# Altium project Temp_sensor_can.PrjPcb
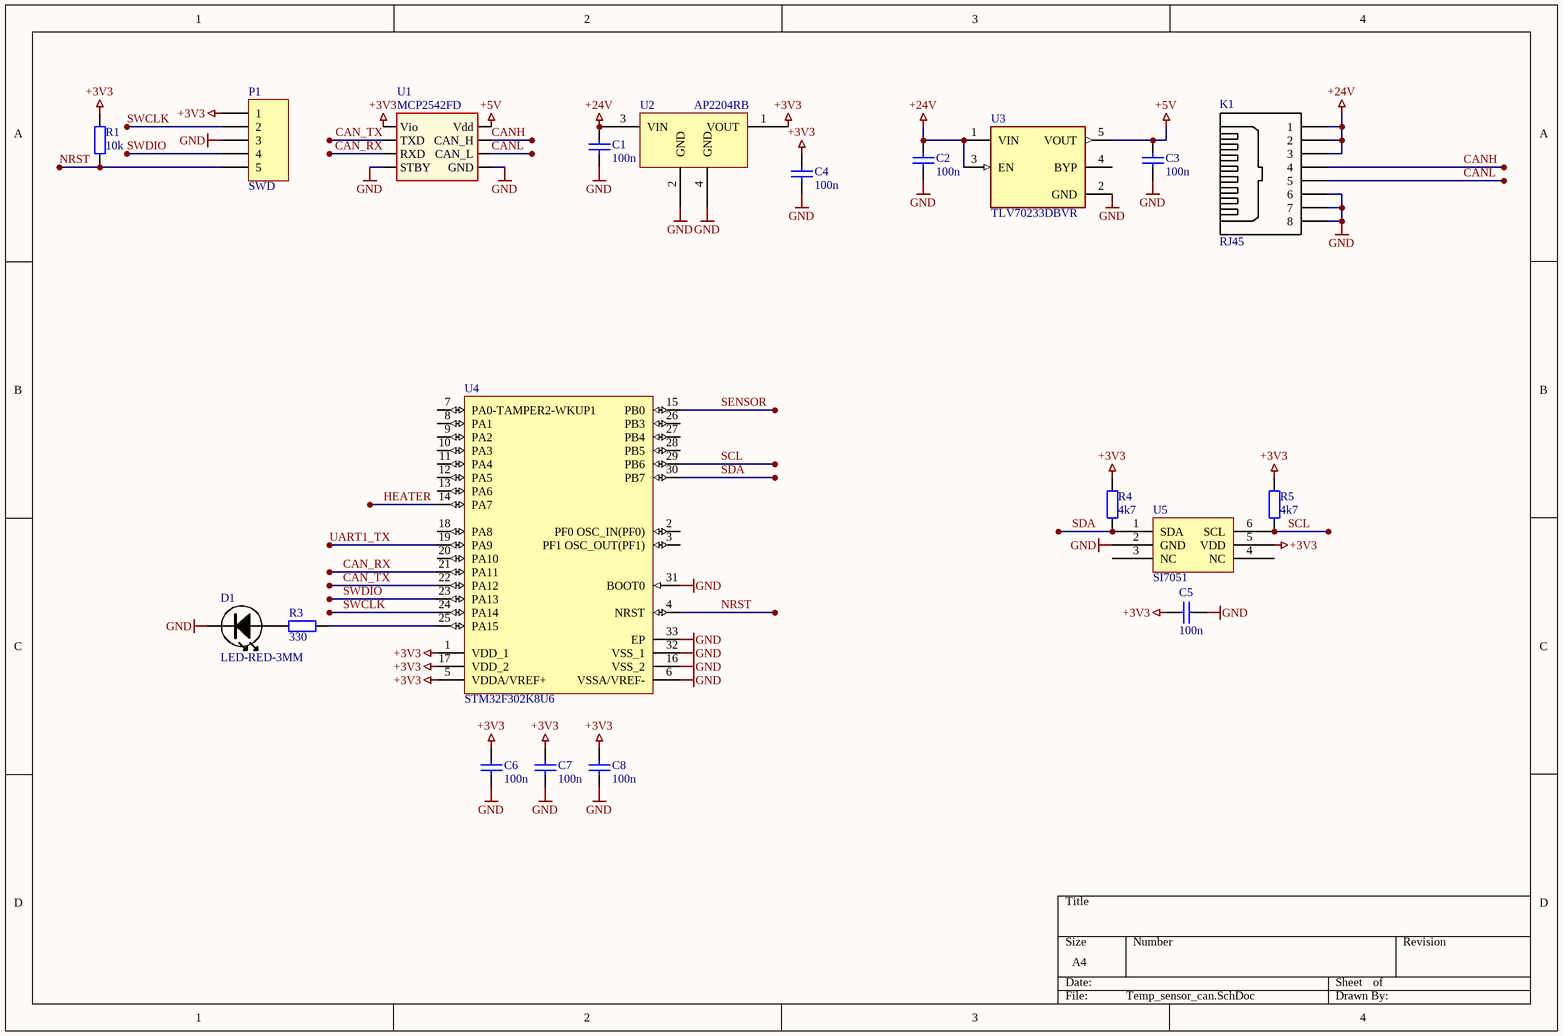
[diagram p0: Temp_sensor_can.SchDoc]
1 sheet, 20 parts. Net scope: global (net labels, ports and power ports of the same name join across sheets).

## Sheet Temp_sensor_can.SchDoc
size A4

### Parts
C1  value 100n  [0603C-GENERIC]  (hidden comment: Cap)
C2  value 100n  [0603C-GENERIC]  (hidden comment: Cap)
C3  value 100n  [0603C-GENERIC]  (hidden comment: Cap)
C4  value 100n  [0603C-GENERIC]  (hidden comment: Cap)
C5  value 100n  [0603C-GENERIC]  (hidden comment: Cap)
C6  value 100n  [0603C-GENERIC]  (hidden comment: Cap)
C7  value 100n  [0603C-GENERIC]  (hidden comment: Cap)
C8  value 100n  [0603C-GENERIC]  (hidden comment: Cap)
D1  LED-RED-3MM  [LED-3MM-GREEN]
K1  RJ45  [rj45 - edge]
P1  SWD  [HDR1X5]
R1  value 10k  [0603R-GENERIC]  (hidden comment: Res2)
R3  value 330  [0603R-GENERIC]  (hidden comment: Res2)
R4  value 4k7  [0603R-GENERIC]  (hidden comment: Res2)
R5  value 4k7  [0603R-GENERIC]  (hidden comment: Res2)
U1  MCP2542FD  [SO8]
U2  AP2204RB  [SOT-89]
U3  TLV70233DBVR  [FP-SOT25-IPC_B]
U4  STM32F302K8U6  [UFQFPN32_M]
U5  SI7051  [DFN_6P]

### Nets
+3V3: C4.2 C5.2 C6.1 C7.1 C8.1 P1.1 R1.2 R4.2 R5.2 U1.5(Vio) U2.1(VOUT) U4.1(VDD_1) U4.5(VDDA/VREF+) U4.17(VDD_2) U5.5(VDD)
+5V: C3.2 U1.3(Vdd) U3.5(VOUT)
+24V: C1.2 C2.2 K1.1 K1.2 K1.3 U2.3(VIN) U3.1(VIN) U3.3(EN)
GND: C1.1 C2.1 C3.1 C4.1 C5.1 C6.2 C7.2 C8.2 D1.K K1.6 K1.7 K1.8 P1.3 U1.2(GND) U1.8(STBY) U2.2(GND) U2.4(GND) U3.2(GND) U4.6(VSSA/VREF-) U4.16(VSS_2) U4.31(BOOT0) U4.32(VSS_1) U4.33(EP) U5.2(GND)
CAN_RX: U1.4(RXD) U4.21(PA11)
CAN_TX: U1.1(TXD) U4.22(PA12)
CANH: K1.4 U1.7(CAN_H)
CANL: K1.5 U1.6(CAN_L)
HEATER: U4.14(PA7)
NRST: P1.5 R1.1 U4.4(NRST)
SCL: R5.1 U4.29(PB6) U5.6(SCL)
SDA: R4.1 U4.30(PB7) U5.1(SDA)
SENSOR: U4.15(PB0)
SWCLK: P1.2 U4.24(PA14)
SWDIO: P1.4 U4.23(PA13)
UART1_TX: U4.19(PA9)
NetD1_A: D1.A R3.1
NetR3_2: R3.2 U4.25(PA15)

Not connected (* = marked no-connect by the designer): U3 4(BYP); U4 2(PF0_OSC_IN(PF0)) 3(PF1_OSC_OUT(PF1)) 7(PA0-TAMPER2-WKUP1) 8(PA1) 9(PA2) 10(PA3) 11(PA4) 12(PA5) 13(PA6) 18(PA8) 20(PA10) 26(PB3) 27(PB4) 28(PB5); U5 3(NC) 4(NC)

### Library data of the parts
C1-C8 = Cap: Capacitor; Published: 8-Jun-2000; LatestRevisionDate: 17-Jul-2002; LatestRevisionNote: Re-released for DXP Platform.; PackageReference: RAD-0.3; Publisher: Altium Limited; PackageDescription: Radial Cap, Thru-Hole; 2 Leads; 0.3 in Pin Spacing
D1 = LED-GREEN-3MM
K1 = RJ45: Text Field1: STEWART CONNECTOR; Text Field2: SS-73100-047; Text Field3: DIGIKEY; Text Field4: 380-1053-ND
P1 = Header 5: Header, 5-Pin; LatestRevisionDate: 17-Jul-2002; LatestRevisionNote: Re-released for DXP Platform.; Publisher: Altium Limited
R1 R3-R5 = Res2: Resistor; Published: 8-Jun-2000; LatestRevisionDate: 17-Jul-2002; LatestRevisionNote: Re-released for DXP Platform.; PackageReference: AXIAL-0.4; Publisher: Altium Limited; PackageDescription: Axial Device, Thru-Hole; 2 Leads; 0.4 in Pin Spacing
U3 = CMP-12756-000010-1: IC REG LINEAR 3.3V 150MA SOT23-5; Manufacturer Part Number: AP2202K-3.3TRG1; Manufacturer: Diodes Inc.; Max Junction Temp: +125°C; Max Supply Voltage: 13.2V; Standoff Height: 0.013mm; Dropout Voltage: 165mV; Nominal Supply Current: 95-1300uA; Accuracy Percentage: 1%; Min Supply Voltage: 2.5V; Output Type: Fixed; Number Of Outputs: 1; RoHS: TRUE; Category: IC; Digikey Description: IC REG LINEAR 3.3V 150MA SOT23-5; ComponentLink2URL: https://www.diodes.com/assets/Datasheets/AP2202.pdf; Lead Free: Yes; Octopart: https://octopart.com/ap2202k-3.3trg1-diodes+inc.-30954618; ComponentLink2Description: Datasheet; Temperature Range High: +125°C; Ipc Land Pattern Name: SOT95P280X115-5; Mouser Description: LDO Voltage Regulators 150mA CMOS LDO 3.3V; Temperature: -40°C to +125°C; Output Current: 150mA; Package: SOT25; Automotive: No; Temperature Range Low: -40°C; Height: 1.4mm; Device Class L2: Power Management ICs; Device Class L3: Voltage Regulators - Linear; Device Class L1: Integrated Circuits (ICs); Output Voltage: 3.3V; Footprint Url: https://www.diodes.com/assets/Package-Files/SOT25.pdf
U4 = CMP-0011-00001-1: ARM Cortex-M4 32-Bit MCU, 64 KB Flash, 16 KB SRAM, 24 I/Os, 2 to 3.6 V, -40 to 85 degC, 32-Pin UFQFPN, RoHS, Tray; Manufacturer: STMicroelectronics; SRAM: 16 KB; Number of I/O: 24; VBAT: 1.65 to 3.6 V; Core Size: 32 Bit; fHCLK: 72 MHz Max.; IDD: 0.15 uA Typ.; Flash Memory Size: 64 KB; ComponentLink2URL: http://www.st.com/st-web-ui/static/active/en/resource/technical/document/datasheet/DM00093333.pdf; VDD: 2 to 3.6 V; Temperature Range: -40 to 85 degC; ComponentLink1Description: Manufacturer URL; DatasheetVersion: Rev. 2; PartNumber: STM32F302K8U6; ComponentLink3URL: http://www.st.com/st-web-ui/static/active/en/resource/technical/document/datasheet/DM00093333.pdf; ComponentLink3Description: Package Specification; Packing: Tray; PackageDescription: 32-Pin, Ultra Thin, Fine Pitch Quad Flat No-Lead Package, Body 5 x 5 mm, Pitch 0.5 mm; RoHS: TRUE; Mounting Technology: Surface Mount; ComponentLink1URL: http://www.st.com/web/en/home.html; ComponentLink2Description: Datasheet